# EAGLE design coaches (EAGLE 9.6.2)

## Sheet 1 of 9: BIO
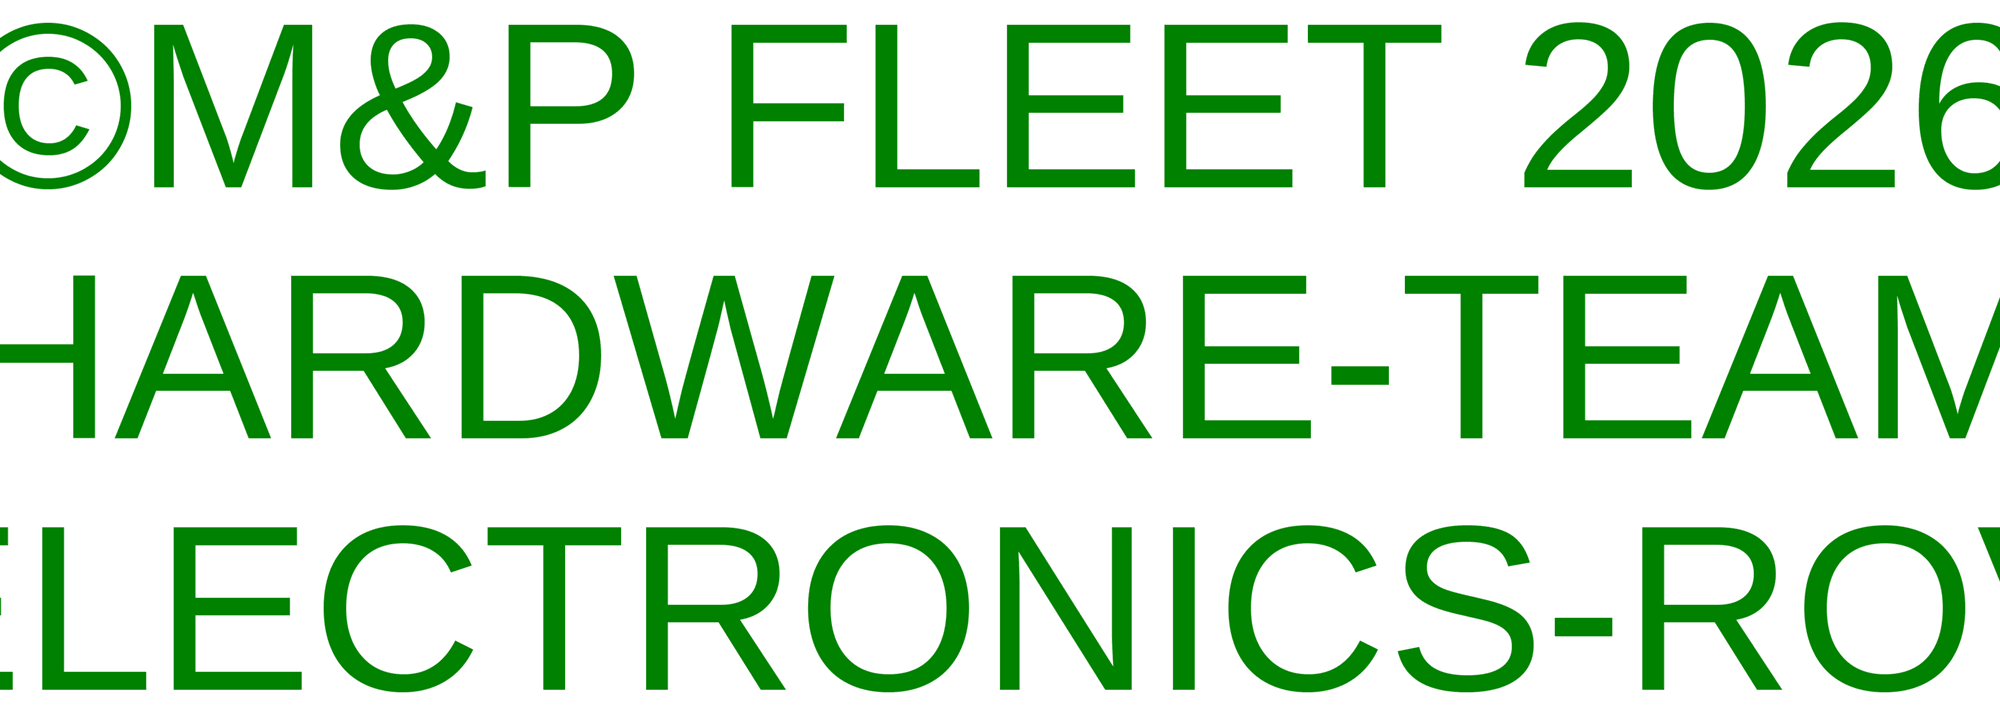
[diagram p0: schematic, sheet 1]

### Notes on the sheet
- ©M&P FLEET 2026
  HARDWARE-TEAM
  ELECTRONICS-ROV

## Sheet 2 of 9: ARDUINO MEGA
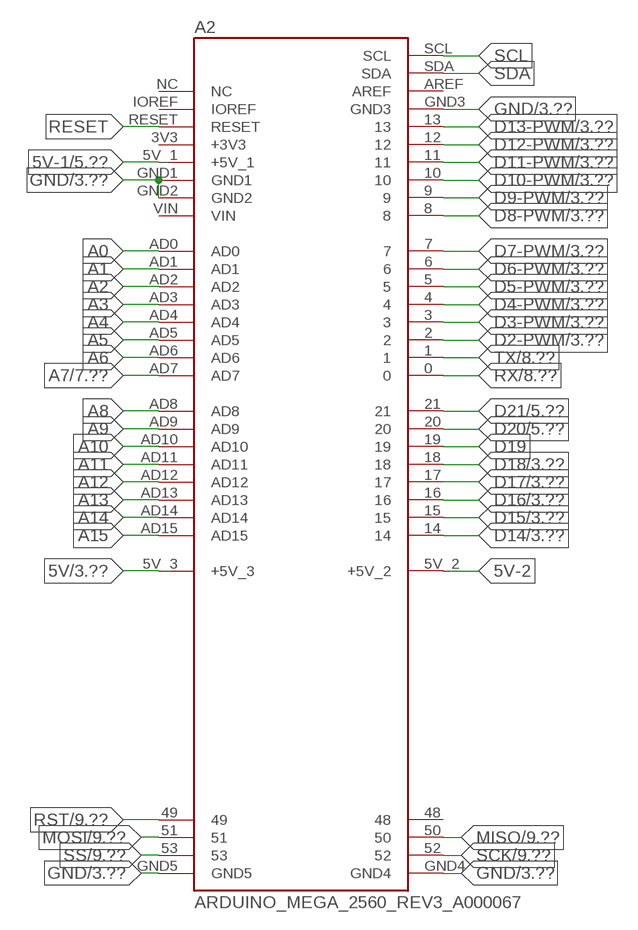
[diagram p1: schematic, sheet 2]

### Parts
A2  ARDUINO_MEGA_2560_REV3_A000067  [ARDUINO_ARDUINO_MEGA_2560_REV3_A000067]

### Nets
5V: A2.5V_3(+5V_3) ; also sheet 3,4,7,9
5V-1: A2.5V_1(+5V_1) ; also sheet 5,6
5V-2: A2.5V_2(+5V_2)
A0: A2.AD0
A1: A2.AD1
A2: A2.AD2
A3: A2.AD3
A4: A2.AD4
A5: A2.AD5
A6: A2.AD6
A7: A2.AD7 ; also sheet 7
A8: A2.AD8
A9: A2.AD9
A10: A2.AD10
A11: A2.AD11
A12: A2.AD12
A13: A2.AD13
A14: A2.AD14
A15: A2.AD15
D2-PWM: A2.2 ; also sheet 3
D3-PWM: A2.3 ; also sheet 3
D4-PWM: A2.4 ; also sheet 3
D5-PWM: A2.5 ; also sheet 3
D6-PWM: A2.6 ; also sheet 3
D7-PWM: A2.7 ; also sheet 3
D8-PWM: A2.8 ; also sheet 3
D9-PWM: A2.9 ; also sheet 3
D10-PWM: A2.10 ; also sheet 3
D11-PWM: A2.11 ; also sheet 3
D12-PWM: A2.12 ; also sheet 3
D13-PWM: A2.13 ; also sheet 3
D14: A2.14 ; also sheet 3
D15: A2.15 ; also sheet 3
D16: A2.16 ; also sheet 3
D17: A2.17 ; also sheet 3
D18: A2.18 ; also sheet 3
D19: A2.19
D20: A2.20 ; also sheet 5,6
D21: A2.21 ; also sheet 5,6
GND: A2.GND1 A2.GND2 A2.GND3 A2.GND4 A2.GND5 ; also sheet 3,4,5,6,7,8,9
MISO: A2.50 ; also sheet 9
MOSI: A2.51 ; also sheet 9
RESET: A2.RESET
RST: A2.49 ; also sheet 9
RX: A2.0 ; also sheet 8
SCK: A2.52 ; also sheet 9
SCL: A2.SCL
SDA: A2.SDA
SS: A2.53 ; also sheet 9
TX: A2.1 ; also sheet 8
Unconnected: A2.3V3(+3V3) A2.48 A2.AREF A2.IOREF A2.NC A2.VIN

## Sheet 3 of 9: Motors
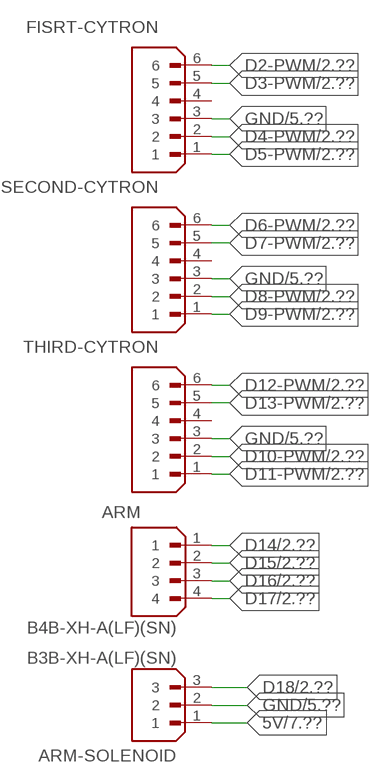
[diagram p2: schematic, sheet 3]

### Parts
ARM  B4B-XH-A(LF)(SN)  [JST_B4B-XH-A(LF)(SN)]
ARM-SOLENOID  B3B-XH-A(LF)(SN)  [JST_B3B-XH-A(LF)(SN)]
FISRT-CYTRON  B6B-XH-A(LF)(SN)  [JST_B6B-XH-A(LF)(SN)]
SECOND-CYTRON  B6B-XH-A(LF)(SN)  [JST_B6B-XH-A(LF)(SN)]
THIRD-CYTRON  B6B-XH-A(LF)(SN)  [JST_B6B-XH-A(LF)(SN)]

### Nets
5V: ARM-SOLENOID.1 ; also sheet 2,4,7,9
D2-PWM: FISRT-CYTRON.6 ; also sheet 2
D3-PWM: FISRT-CYTRON.5 ; also sheet 2
D4-PWM: FISRT-CYTRON.2 ; also sheet 2
D5-PWM: FISRT-CYTRON.1 ; also sheet 2
D6-PWM: SECOND-CYTRON.6 ; also sheet 2
D7-PWM: SECOND-CYTRON.5 ; also sheet 2
D8-PWM: SECOND-CYTRON.2 ; also sheet 2
D9-PWM: SECOND-CYTRON.1 ; also sheet 2
D10-PWM: THIRD-CYTRON.2 ; also sheet 2
D11-PWM: THIRD-CYTRON.1 ; also sheet 2
D12-PWM: THIRD-CYTRON.6 ; also sheet 2
D13-PWM: THIRD-CYTRON.5 ; also sheet 2
D14: ARM.1 ; also sheet 2
D15: ARM.2 ; also sheet 2
D16: ARM.3 ; also sheet 2
D17: ARM.4 ; also sheet 2
D18: ARM-SOLENOID.3 ; also sheet 2
GND: ARM-SOLENOID.2 FISRT-CYTRON.3 SECOND-CYTRON.3 THIRD-CYTRON.3 ; also sheet 2,4,5,6,7,8,9
Unconnected: FISRT-CYTRON.4 SECOND-CYTRON.4 THIRD-CYTRON.4

## Sheet 4 of 9: power plan
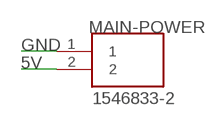
[diagram p3: schematic, sheet 4]

### Parts
MAIN-POWER  1546833-2  [TE_1546833-2]

### Nets
5V: MAIN-POWER.2 ; also sheet 2,3,7,9
GND: MAIN-POWER.1 ; also sheet 2,3,5,6,7,8,9

## Sheet 5 of 9: MPU
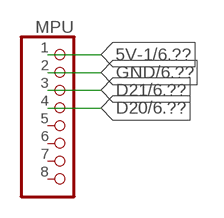
[diagram p4: schematic, sheet 5]

### Parts
MPU  PINHD-1X8  [1X08]

### Nets
5V-1: MPU.1 ; also sheet 2,6
D20: MPU.4 ; also sheet 2,6
D21: MPU.3 ; also sheet 2,6
GND: MPU.2 ; also sheet 2,3,4,6,7,8,9
Unconnected: MPU.5 MPU.6 MPU.7 MPU.8

## Sheet 6 of 9: BMP180 GY-68 Barometric Pressure Sensor
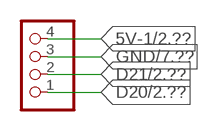
[diagram p5: schematic, sheet 6]

### Parts
PROMETER  PINHD-1X4  [1X04]

### Nets
5V-1: PROMETER.4 ; also sheet 2,5
D20: PROMETER.1 ; also sheet 2,5
D21: PROMETER.2 ; also sheet 2,5
GND: PROMETER.3 ; also sheet 2,3,4,5,7,8,9

## Sheet 7 of 9: LEAKAGE SENSOR
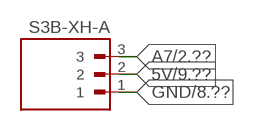
[diagram p6: schematic, sheet 7]

### Parts
J3  S3B-XH-A  [JST_S3B-XH-A]

### Nets
5V: J3.2 ; also sheet 2,3,4,9
A7: J3.3 ; also sheet 2
GND: J3.1 ; also sheet 2,3,4,5,6,8,9

## Sheet 8 of 9: to FTDI
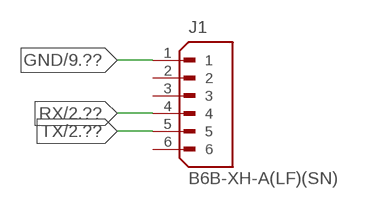
[diagram p7: schematic, sheet 8]

### Parts
J1  B6B-XH-A(LF)(SN)  [JST_B6B-XH-A(LF)(SN)]

### Nets
GND: J1.1 ; also sheet 2,3,4,5,6,7,9
RX: J1.4 ; also sheet 2
TX: J1.5 ; also sheet 2
Unconnected: J1.2 J1.3 J1.6

## Sheet 9 of 9: to spi
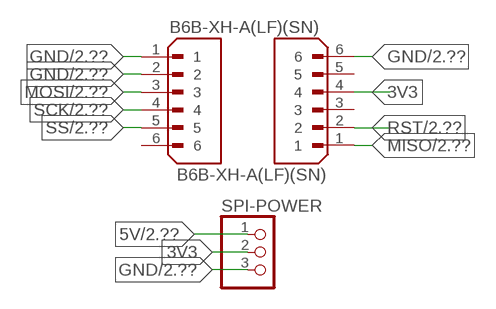
[diagram p8: schematic, sheet 9]

### Parts
J2  B6B-XH-A(LF)(SN)  [JST_B6B-XH-A(LF)(SN)]
J4  B6B-XH-A(LF)(SN)  [JST_B6B-XH-A(LF)(SN)]
SPI-POWER  PINHD-1X3  [1X03]

### Nets
3V3: J4.4 SPI-POWER.2
5V: SPI-POWER.1 ; also sheet 2,3,4,7
GND: J2.1 J2.2 J4.6 SPI-POWER.3 ; also sheet 2,3,4,5,6,7,8
MISO: J4.1 ; also sheet 2
MOSI: J2.3 ; also sheet 2
RST: J4.2 ; also sheet 2
SCK: J2.4 ; also sheet 2
SS: J2.5 ; also sheet 2
Unconnected: J2.6 J4.3 J4.5

## Library data of the parts
A2 = Arduino mega for ROV:ARDUINO_MEGA_2560_REV3_A000067: Check availability <https://pricing.snapeda.com/parts/ARDUINO%20MEGA%202560%20REV3%20%7C%20A000067/Arduino/view-part?ref=eda>; AVAILABILITY: Not in stock; CHECK_PRICES: https://www.snapeda.com/parts/ARDUINO%20MEGA%202560%20REV3%20%7C%20A000067/Arduino/view-part/?ref=eda; DESCRIPTION: ATmega2560 Arduino Mega2560 AVR® ATmega AVR MCU 8-Bit Embedded Evaluation Board; MF: Arduino; MP: ARDUINO MEGA 2560 REV3 | A000067; PACKAGE: Non-Standard Arduino; PRICE: None; PURCHASE-URL: https://www.snapeda.com/api/url_track_click_mouser/?unipart_id=7072122&manufacturer=Arduino&part_name=ARDUINO MEGA 2560 REV3 | A000067&search_term=None; SNAPEDA_LINK: https://www.snapeda.com/parts/ARDUINO%20MEGA%202560%20REV3%20%7C%20A000067/Arduino/view-part/?ref=snap
ARM = data-cable(4-pin):B4B-XH-A(LF)(SN): Check availability <https://pricing.snapeda.com/parts/B4B-XH-A%20%28LF%29%28SN%29/JST%20Sales/view-part?ref=eda>; AVAILABILITY: In Stock; CHECK_PRICES: https://www.snapeda.com/parts/B4B-XH-A%20(LF)(SN)/JST/view-part/?ref=eda; DESCRIPTION: Connector Header Through Hole 4 position 0.098 (2.50mm); MF: JST Sales; MP: B4B-XH-A (LF)(SN); PACKAGE: None; PRICE: None; SNAPEDA_LINK: https://www.snapeda.com/parts/B4B-XH-A%20(LF)(SN)/JST/view-part/?ref=snap
ARM-SOLENOID = data cable 3pins:B3B-XH-A(LF)(SN): Check availability <https://pricing.snapeda.com/parts/B3B-XH-A%28LF%29%28SN%29/JST%20Sales/view-part?ref=eda>; AVAILABILITY: In Stock; CHECK_PRICES: https://www.snapeda.com/parts/B3B-XH-A(LF)(SN)/JST/view-part/?ref=eda; DESCRIPTION: Connector Header Through Hole 3 position 0.098 (2.50mm); MF: JST Sales; MP: B3B-XH-A(LF)(SN); PACKAGE: None; PRICE: None; SNAPEDA_LINK: https://www.snapeda.com/parts/B3B-XH-A(LF)(SN)/JST/view-part/?ref=snap
FISRT-CYTRON J1 J2 J4 SECOND-CYTRON THIRD-CYTRON = data-cable(6-pin):B6B-XH-A(LF)(SN): Check availability <https://pricing.snapeda.com/parts/B6B-XH-A%20%28LF%29%28SN%29/JST%20Sales/view-part?ref=eda>; AVAILABILITY: In Stock; CHECK_PRICES: https://www.snapeda.com/parts/B6B-XH-A%20(LF)(SN)/JST/view-part/?ref=eda; DESCRIPTION: Connector Header Through Hole 6 position 0.098 (2.50mm); MF: JST Sales; MP: B6B-XH-A (LF)(SN); PACKAGE: None; PRICE: None; SNAPEDA_LINK: https://www.snapeda.com/parts/B6B-XH-A%20(LF)(SN)/JST/view-part/?ref=snap
J3 = S3B-XH-A:S3B-XH-A: Check availability <https://pricing.snapeda.com/parts/S3B-XH-A/JST/view-part?ref=eda>; AVAILABILITY: In Stock; CHECK_PRICES: https://www.snapeda.com/parts/S3B-XH-A/JST/view-part/?ref=eda; DESCRIPTION: Connector Header Through Hole, Right Angle 3 position 0.098 (2.50mm); MF: JST; MP: S3B-XH-A; PACKAGE: None; PRICE: None; SNAPEDA_LINK: https://www.snapeda.com/parts/S3B-XH-A/JST/view-part/?ref=snap
MAIN-POWER = barrier terminal block 9.5mm:1546833-2: Check availability <https://pricing.snapeda.com/parts/1546833-2/TE%20Connectivity/view-part?ref=eda>; AVAILABILITY: In Stock; CHECK_PRICES: https://www.snapeda.com/parts/1546833-2/TE+Connectivity+AMP+Connectors/view-part/?ref=eda; COMMENT: 1546833-2; DESCRIPTION: 2 Circuit 0.375 (9.53mm) Barrier Block Connector, Screws with Captive Plate; MF: TE Connectivity; MP: 1546833-2; PACKAGE: None; PRICE: None; SNAPEDA_LINK: https://www.snapeda.com/parts/1546833-2/TE+Connectivity+AMP+Connectors/view-part/?ref=snap
MPU = pinhead:PINHD-1X8: PIN HEADER
PROMETER = pinhead:PINHD-1X4: PIN HEADER
SPI-POWER = pinhead:PINHD-1X3: PIN HEADER

## Board
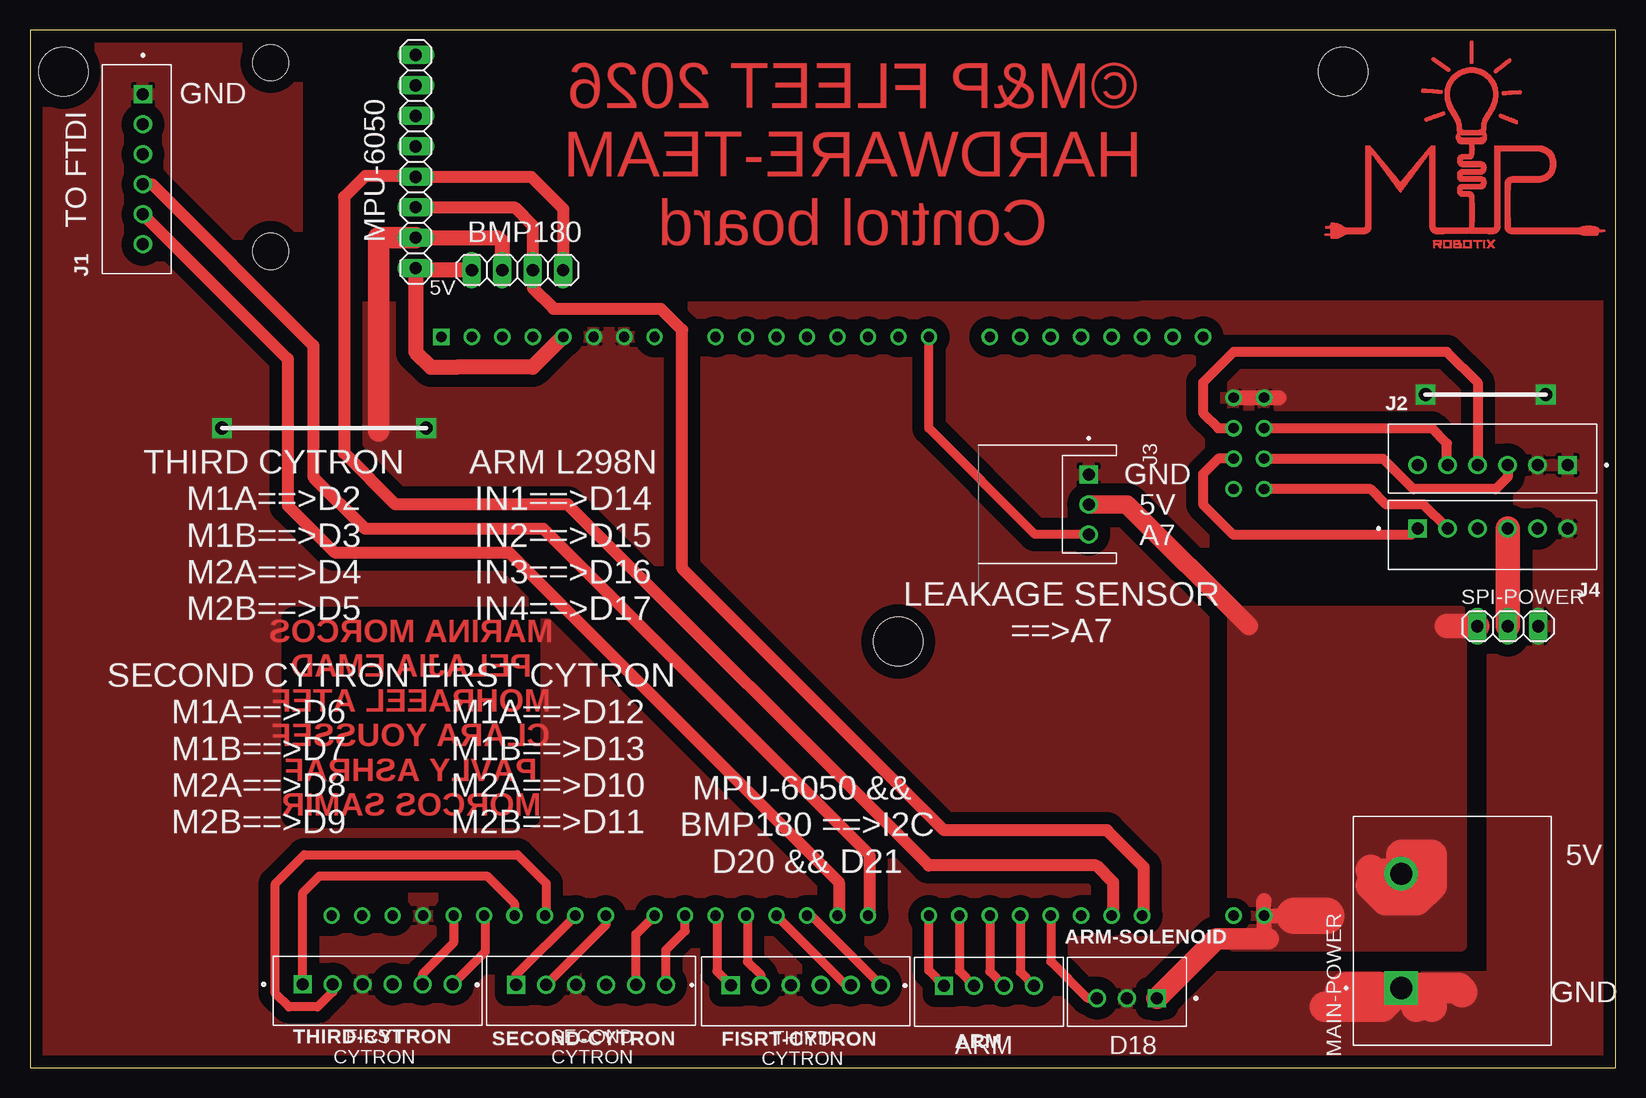
[diagram p9: board, top side]
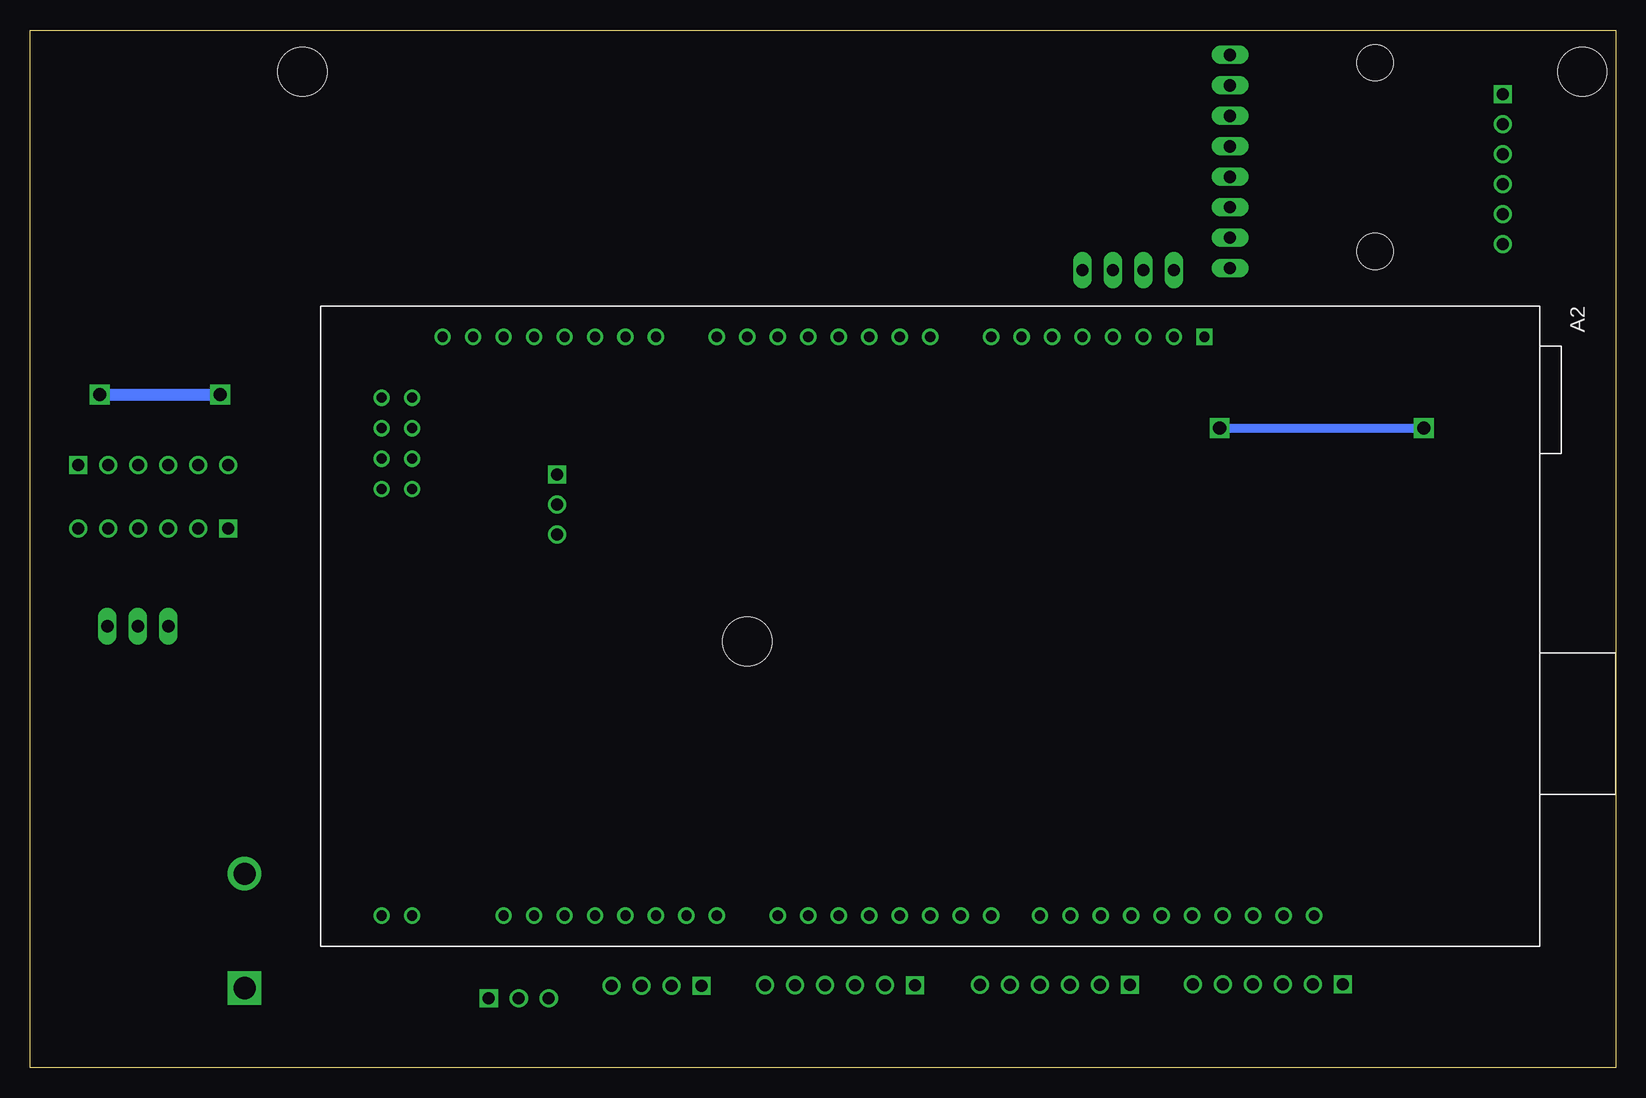
[diagram p10: board, bottom side, seen from below]

Size 132.19 x 86.54 mm. Coordinates in mm from the lower left corner, seen from the top.
Outline: 0,0 132.19,0 132.19,86.54 0,86.54 0,0
Copper layers (1*16): Top 0.035mm / dielectric 1.5mm / Bottom 0.035mm
Design rules "default": minimum track width 6mil, minimum drill 0.35mm, track to track 6mil, track to pad 6mil, pad to pad 6mil, via to via 6mil, smd to smd 6mil, copper to edge 40mil, drill to drill 6mil, minimum pad ring 10mil, minimum via ring 8mil, stop-mask expansion 4mil, vias tented up to drill 0mil, thermal gap 10mil
Holes 4.1 mm at 2.79,83.06 109.47,83.06 72.39,35.56
Holes 3 mm at 20.07,68.07 20.07,83.82

### Footprints (pad centres in the part's own frame; a part is rotated, then mirrored left to right if it is on the bottom)
ARDUINO_ARDUINO_MEGA_2560_REV3_A000067 = drill 0.85: 0 24.13,-12.7; 1 24.13,-10.16; 2 24.13,-7.62; 3 24.13,-5.08; 3V3 -24.13,15.24; 4 24.13,-2.54; 5 24.13,0; 5V_1 -24.13,12.7; 5V_2 24.13,-43.18; 5V_3 24.13,-45.72; 6 24.13,2.54; 7 24.13,5.08; 8 24.13,9.144; 9 24.13,11.684; 10 24.13,14.224; 11 24.13,16.764; 12 24.13,19.304; 13 24.13,21.844; 14 24.13,-17.78; 15 24.13,-20.32; 16 24.13,-22.86; 17 24.13,-25.4; 18 24.13,-27.94; 19 24.13,-30.48; 20 24.13,-33.02; 21 24.13,-35.56; 48 -11.43,-43.18; 49 -11.43,-45.72; 50 -13.97,-43.18; 51 -13.97,-45.72; 52 -16.51,-43.18; 53 -16.51,-45.72; AD0 -24.13,0; AD1 -24.13,-2.54; AD2 -24.13,-5.08; AD3 -24.13,-7.62; AD4 -24.13,-10.16; AD5 -24.13,-12.7; AD6 -24.13,-15.24; AD7 -24.13,-17.78; AD8 -24.13,-22.86; AD9 -24.13,-25.4; AD10 -24.13,-27.94; AD11 -24.13,-30.48; AD12 -24.13,-33.02; AD13 -24.13,-35.56; AD14 -24.13,-38.1; AD15 -24.13,-40.64; AREF 24.13,26.924; GND1 -24.13,10.16; GND2 -24.13,7.62; GND3 24.13,24.384; GND4 -19.05,-43.18; GND5 -19.05,-45.72; IOREF -24.13,20.32; RESET -24.13,17.78; SCL 24.13,32.004; SDA 24.13,29.464; VIN -24.13,5.08 | drill 0.85 square: NC -24.13,22.86
JST_B4B-XH-A(LF)(SN) = drill 1 square: 1 3.75,-0.525 | drill 1: 2 1.25,-0.525; 3 -1.25,-0.525; 4 -3.75,-0.525
JST_B3B-XH-A(LF)(SN) = drill 1 square: 1 2.5,-0.525 | drill 1: 2 0,-0.525; 3 -2.5,-0.525
JST_B6B-XH-A(LF)(SN) = drill 1 square: 1 6.25,-0.525 | drill 1: 2 3.75,-0.525; 3 1.25,-0.525; 4 -1.25,-0.525; 5 -3.75,-0.525; 6 -6.25,-0.525
JST_S3B-XH-A = drill 1 square: 1 -2.5,5.7 | drill 1: 2 0,5.7; 3 2.5,5.7
TE_1546833-2 = drill 1.85 square: 1 -4.765,0 | drill 1.85: 2 4.765,0
1X08 = drill 1.016 long: 1 -8.89,0; 2 -6.35,0; 3 -3.81,0; 4 -1.27,0; 5 1.27,0; 6 3.81,0; 7 6.35,0; 8 8.89,0
1X04 = drill 1.016 long: 1 -3.81,0; 2 -1.27,0; 3 1.27,0; 4 3.81,0
1X03 = drill 1.016 long: 1 -2.54,0; 2 0,0; 3 2.54,0

### Placement (x,y rotation side)
A2  57.15,36.83 270 bottom
ARM  79.94,6.34 180 top
ARM-SOLENOID  91.44,6.34 0 top
FISRT-CYTRON  64.67,6.38 180 top
J1  8.89,74.93 90 top
J2  121.92,50.8 0 top
J3  82.55,46.99 270 top
J4  121.92,44.45 180 top
MAIN-POWER  114.3,11.43 90 top
MPU  32.16,75.56 90 top
PROMETER  40.64,66.52 180 top
SECOND-CYTRON  46.76,6.42 180 top
SPI-POWER  123.19,36.83 0 top
THIRD-CYTRON  28.98,6.45 180 top

### Tracks (layer width: path | path; a pad name or v marks a point on that pad's centre or on a via)
3V3
  Top 2.032: J4.4 123.19,44.95 SPI-POWER.2
5V
  Top 1.27: A2.5V_3 104.14,12.7 | A2.5V_3 102.87,13.97 | A2.5V_3 102.87,11.43
  Top 1.524: 101.6,36.83 91.44,46.99 J3.2
  Top 1.778: 103.22,10.77 98.89,10.77 ARM-SOLENOID.1
  Top 2.032: SPI-POWER.1 118.11,36.83
  Top 2.54: 111.76,16.51 112.08,16.2 MAIN-POWER.2 114.3,17.78 116.84,17.78 116.84,15.24 115.57,13.97 113.03,13.97 111.76,15.24
  Top 3.048: 108.06,12.7 105.41,12.7
  pour Top (isolate 0.762): 100.2,38.1 100.2,10.16 119.38,10.16 119.38,38.1
5V-1
  Top 1.27: PROMETER.4 32.31,66.52 MPU.1 32.16,59.69 33.43,58.42 35.56,58.42 41.91,58.42 A2.5V_1
A7
  Top 0.762: J3.3 83.78,44.49 74.93,53.34 A2.AD7
D2-PWM
  Top 0.762: A2.2 65.13,12.7 FISRT-CYTRON.6
D3-PWM
  Top 0.762: A2.3 68.02,6.91 FISRT-CYTRON.5
D4-PWM
  Top 0.762: FISRT-CYTRON.2 60.92,7.75 59.8,8.87 59.8,12.59 A2.4
D5-PWM
  Top 0.762: FISRT-CYTRON.1 57.26,8.07 57.26,12.59 A2.5
D6-PWM
  Top 0.762: SECOND-CYTRON.6 53.01,9.83 54.61,11.43 A2.6
D7-PWM
  Top 0.762: SECOND-CYTRON.5 50.51,11.14 A2.7
D8-PWM
  Top 0.762: A2.8 48.01,11.94 SECOND-CYTRON.2
D9-PWM
  Top 0.762: SECOND-CYTRON.1 40.51,7.75 A2.9
D10-PWM
  Top 0.762: A2.10 43.04,12.81 43.04,15.38 40.64,17.78 22.86,17.78 20.45,15.37 20.45,6.22 21.59,5.08 23.97,5.08 25.23,6.34 THIRD-CYTRON.2
D11-PWM
  Top 0.762: A2.11 40.39,13.72 38.1,16 24.13,16 22.73,14.61 THIRD-CYTRON.1
D12-PWM
  Top 0.762: THIRD-CYTRON.6 37.96,9.7 37.96,12.59 A2.12
D13-PWM
  Top 0.762: THIRD-CYTRON.5 32.73,7.84 35.31,10.41 A2.13
D14
  Top 0.762: ARM.1 74.93,8.13 A2.14
D15
  Top 0.762: ARM.2 77.47,8.09 A2.15
D16
  Top 0.762: ARM.3 80.01,8.05 A2.16
D17
  Top 0.762: ARM.4 82.55,8.01 A2.17
D18
  Top 0.762: A2.18 85.09,8.89 88.16,5.82 ARM-SOLENOID.3
D20
  Top 1.016: PROMETER.1 44.45,71.63 41.78,74.3 MPU.4 32.09,74.36 27.94,74.36 26.18,72.6 26.18,51.26 30.45,46.99 44.83,46.99 74.93,16.89 88.88,16.89 90.28,15.49 90.28,12.81 A2.20
D21
  Top 1.016: MPU.3 40.39,71.75 41.91,70.23 PROMETER.2 41.91,65.02 43.63,63.3 52.58,63.3 54.36,61.52 54.36,41.66 76.2,19.81 89.77,19.81 92.82,16.76 92.82,12.81 A2.21
GND  (via drill 1.1)
  Top 1.27: MPU.2 38.99,69.22 39.37,68.83 PROMETER.3 | A2.GND4 A2.GND5 104.14,55.88
  Top 1.778: MPU.2 29.08,69.22 29.08,53.09
  Top 2.54: MAIN-POWER.1 112.72,5.08 107.95,5.08 | MAIN-POWER.1 115.25,6.67 116.84,5.08 | MAIN-POWER.1 115.57,5.39 115.57,5.08 | MAIN-POWER.1 113.98,6.35
  Top 2.591: 109.22,6.35 109.53,6.67 MAIN-POWER.1 119.06,6.67 119.38,6.35
  Bottom 0.762: v33.02,53.34 v16,53.34
  Bottom 1.016: v126.36,56.13 v116.33,56.13
  pour Top (isolate 1.016): 0.28,85.62 0.28,57.28 22.25,57.28 22.25,85.62
  pour Top (isolate 1.016): 92.71,63.5 132.08,63.5 132.08,0 92.71,0 92.71,7.62 121.92,7.62 121.92,39.75 92.71,39.75
  pour Top (isolate 1.016): 0.03,63.37 0.03,0 97.84,0 97.84,63.37
MISO
  Top 0.813: J4.1 115.14,44.45 100.33,44.45 97.79,46.99 97.79,49.53 99.06,50.8 A2.50
MOSI
  Top 0.813: A2.51 112.78,50.8 115.32,48.26 122.17,48.26 123.17,49.26 J2.3
RST
  Top 0.813: J4.2 116.16,46.99 113.03,46.99 111.76,48.26 A2.49
RX
  Top 1.016: J1.4 10.18,73.68 23.62,60.24 23.62,49.28 27.94,44.96 42.77,44.96 69.96,17.77 69.96,12.81 A2.0
SCK
  Top 0.813: J2.4 120.67,57.13 118.11,59.69 100.33,59.69 97.79,57.15 97.79,54.61 99.06,53.34 A2.52
SS
  Top 0.813: A2.53 116.84,53.34 118.11,52.07 118.11,50.34 J2.5
TX
  Top 1.016: A2.1 67.42,12.81 67.42,15.49 39.94,42.98 25.4,42.98 21.49,46.89 21.49,59.11 J1.5
(copper drawn outside any net)
  shapes: Top area x2659

### Text on the board
Top: ©M&P FLEET 2026 / HARDWARE-TEAM / Control board | MARINA MORCOS / PELAJIA EMAD / MOHRAEEL ATEF / CLARA YOUSSEF / PAVLY ASHRAF / MORCOS SAMIR
tPlace: GND | TO FTDI | MPU-6050 | BMP180 | 5V | GND | 5V | THIRD CYTRON / M1A==>D2 / M1B==>D3 / M2A==>D4 / M2B==>D5 | ARM L298N / IN1==>D14 / IN2==>D15 / IN3==>D16 / IN4==>D17 | A7 | LEAKAGE SENSOR / ==>A7 | SECOND CYTRON / M1A==>D6 / M1B==>D7 / M2A==>D8 / M2B==>D9 | FIRST CYTRON / M1A==>D12 / M1B==>D13 / M2A==>D10 / M2B==>D11 | MPU-6050 && / BMP180 ==>I2C / D20 && D21 | 5V | GND | FIRST / CYTRON | SECOND / CYTRON | THIRD / CYTRON | ARM | D18